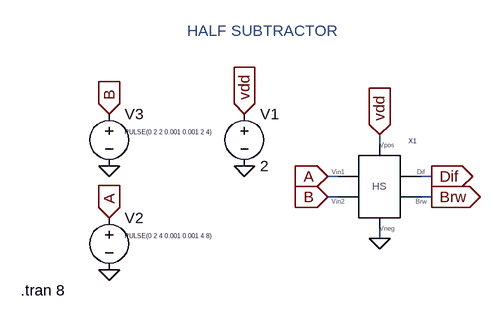
[diagram p0: schematic HS block.asc]
HS block.asc, the LTspice schematic file:
Version 4
SHEET 1 880 680
WIRE 288 160 288 144
WIRE 224 208 208 208
WIRE 368 208 352 208
WIRE 224 240 208 240
WIRE 368 240 352 240
WIRE 288 304 288 288
FLAG 80 112 vdd
IOPIN 80 112 In
FLAG -128 272 A
IOPIN -128 272 In
FLAG -128 112 B
IOPIN -128 112 In
FLAG 80 192 0
FLAG -128 352 0
FLAG -128 192 0
FLAG 288 144 vdd
IOPIN 288 144 In
FLAG 208 208 A
IOPIN 208 208 In
FLAG 208 240 B
IOPIN 208 240 In
FLAG 288 304 0
FLAG 368 208 Dif
IOPIN 368 208 Out
FLAG 368 240 Brw
IOPIN 368 240 Out
SYMBOL hsub 304 224 R0
SYMATTR InstName X1
SYMBOL voltage 80 96 R0
WINDOW 123 0 0 Left 0
WINDOW 39 0 0 Left 0
SYMATTR InstName V1
SYMATTR Value 2
SYMBOL voltage -128 256 R0
WINDOW 3 24 44 Left 0
WINDOW 123 0 0 Left 0
WINDOW 39 0 0 Left 0
SYMATTR Value PULSE(0 2 4 0.001 0.001 4 8)
SYMATTR InstName V2
SYMBOL voltage -128 96 R0
WINDOW 3 24 44 Left 0
WINDOW 123 0 0 Left 0
WINDOW 39 0 0 Left 0
SYMATTR Value PULSE(0 2 2 0.001 0.001 2 4)
SYMATTR InstName V3
TEXT -264 384 Left 2 !.tran 8
TEXT -8 -16 Left 2 ;HALF SUBTRACTOR

The netlist it stands for:
* HS block.asc
XX1 vdd A B 0 Dif Brw hsub  ; pins vdd A B gnd Dif Brw
V1 vdd 0 2
V2 A 0 PULSE(0 2 4 0.001 0.001 4 8)
V3 B 0 PULSE(0 2 2 0.001 0.001 2 4)
.tran 8
* HALF SUBTRACTOR
.backanno
.end

* Results of the author's LTspice run, read from the files saved beside the schematic
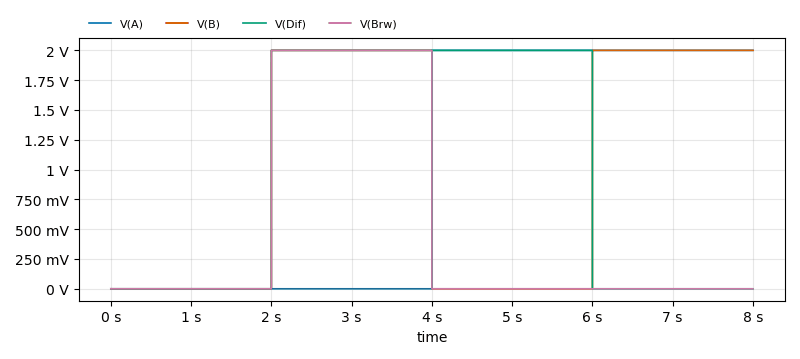
[diagram p1: Transient Analysis of HS block.asc, plotted from the saved traces]
* Transient Analysis, 1 run:
*   V(A): min 0 V, max 2 V, average 999.9 mV, rms 1.414 V, last 2 V
*   V(B): min 0 V, max 2 V, average 1 V, rms 1.414 V, last 2 V
*   V(Dif): min 400.9 nV, max 2 V, average 999.8 mV, rms 1.414 V, last 400.9 nV
*   V(Brw): min 0 V, max 2 V, average 500 mV, rms 1 V, last 0 V